# Altium schematic sheet wyswietlacz.SchDoc: Oled display
size A4
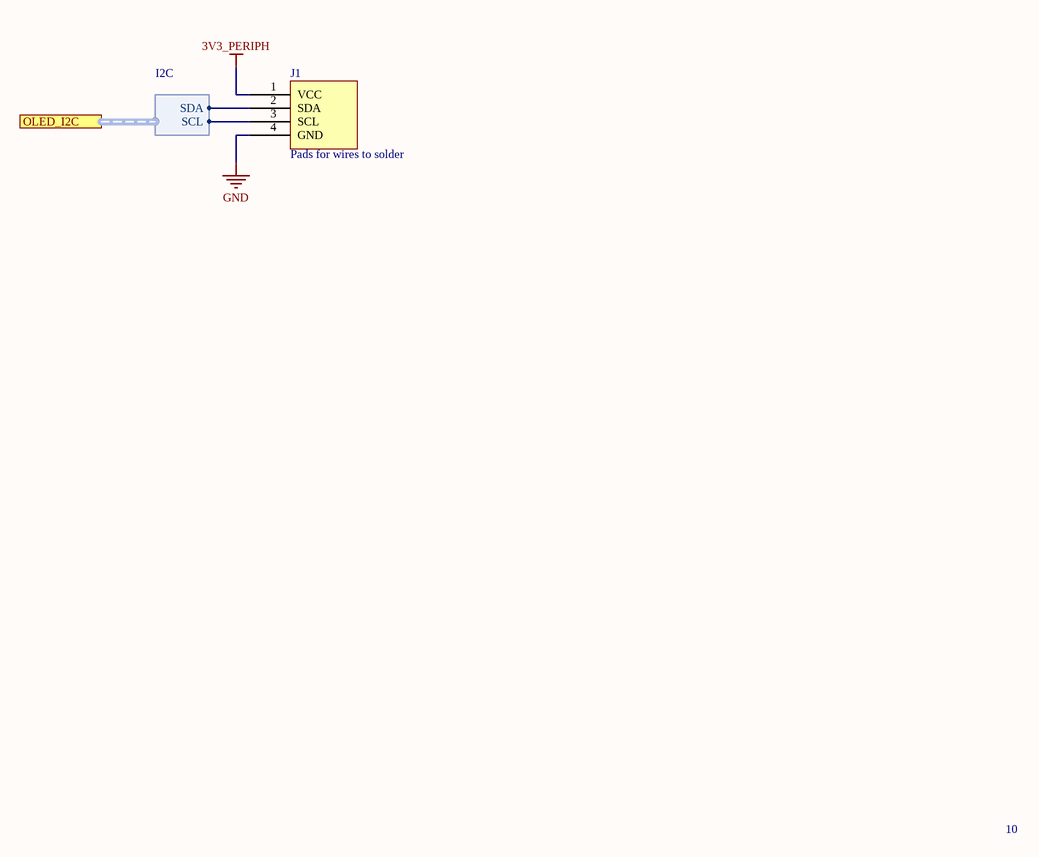
[diagram p0: wyswietlacz.SchDoc]

## Parts
J1  Pads for wires to solder  [OLED_PAD]

## Ports
OLED_I2C (harness I2C)

## Harnesses
I2C: SCL, SDA

## Nets
3V3_PERIPH: J1.1(VCC)
GND: J1.4(GND)
NetJ1_2: J1.2(SDA) ; port OLED_I2C.SDA
NetJ1_3: J1.3(SCL) ; port OLED_I2C.SCL

## Notes on the sheet
- 10

## Library data of the parts
J1 = OLED_connector